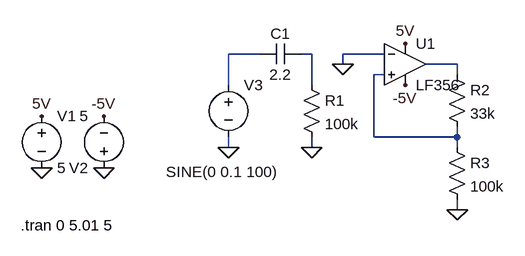
[diagram p0: schematic HIghPassAndOpampTest.asc]
HIghPassAndOpampTest.asc, the LTspice schematic file:
Version 4
SHEET 1 880 680
WIRE -48 144 -96 144
WIRE 32 144 16 144
WIRE 144 144 80 144
WIRE 80 160 80 144
WIRE 256 160 208 160
WIRE 144 176 128 176
WIRE 256 176 256 160
WIRE -96 192 -96 144
WIRE 32 192 32 144
WIRE 128 272 128 176
WIRE 256 272 256 256
WIRE 256 272 128 272
WIRE -96 288 -96 272
WIRE 32 288 32 272
WIRE 256 288 256 272
WIRE 256 384 256 368
FLAG 32 288 0
FLAG 256 384 0
FLAG -288 320 0
FLAG -384 320 0
FLAG -288 240 -5V
FLAG -384 240 5V
FLAG -96 288 0
FLAG 176 192 -5V
FLAG 176 128 5V
FLAG 80 160 0
SYMBOL res 16 176 R0
SYMATTR InstName R1
SYMATTR Value 100k
SYMBOL res 240 160 R0
SYMATTR InstName R2
SYMATTR Value 33k
SYMBOL res 240 272 R0
SYMATTR InstName R3
SYMATTR Value 100k
SYMBOL voltage -384 224 R0
WINDOW 123 0 0 Left 0
WINDOW 39 0 0 Left 0
SYMATTR InstName V1
SYMATTR Value 5
SYMBOL voltage -288 336 R180
WINDOW 123 0 0 Left 0
WINDOW 39 0 0 Left 0
SYMATTR InstName V2
SYMATTR Value 5
SYMBOL voltage -96 176 R0
WINDOW 123 0 0 Left 0
WINDOW 39 0 0 Left 0
WINDOW 3 -96 150 Left 2
SYMATTR InstName V3
SYMATTR Value SINE(0 0.1 100)
SYMBOL cap -48 160 R270
WINDOW 0 32 32 VTop 2
WINDOW 3 0 32 VBottom 2
SYMATTR InstName C1
SYMATTR Value 2.2
SYMBOL LF356 176 96 R0
SYMATTR InstName U1
TEXT -416 408 Left 2 !.tran 0 5.01 5

The netlist it stands for:
* HIghPassAndOpampTest.asc
R1 N002 0 100k
R2 N003 N004 33k
R3 N004 0 100k
V1 5V 0 5
V2 0 -5V 5
V3 N001 0 SINE(0 0.1 100)
C1 N001 N002 2.2
XU1 N004 0 5V -5V N003 LF356  ; pins In+ In- V+ V- OUT
.tran 0 5.01 5
.lib LF356.sub
.backanno
.end